# EAGLE design circuit_r2 (EAGLE 9.4.2)
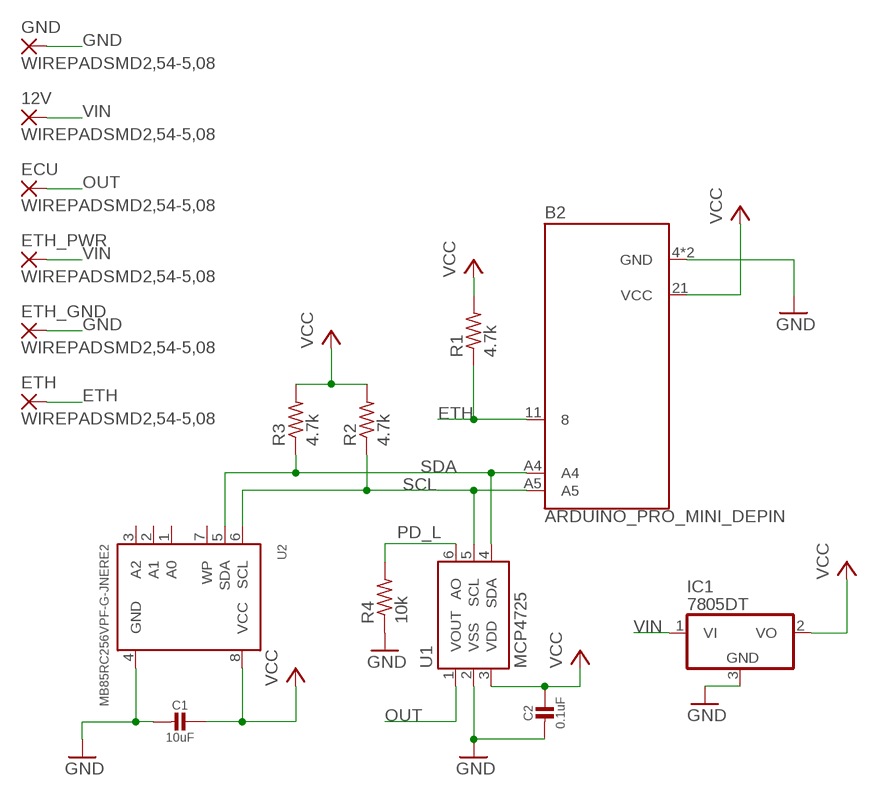
[diagram p0: schematic, sheet 1]

## Parts
12V  WIREPADSMD2,54-5,08  [SMD2,54-5,08]
B2  ARDUINO_PRO_MINI_DEPIN  [ARDUINO_PRO_MINI]
C1  10uF  CAP_CERAMIC_0805MP  [_0805MP]
C2  0.1uF  CAP_CERAMIC_0805MP  [_0805MP]
ECU  WIREPADSMD2,54-5,08  [SMD2,54-5,08]
ETH  WIREPADSMD2,54-5,08  [SMD2,54-5,08]
ETH_GND  WIREPADSMD2,54-5,08  [SMD2,54-5,08]
ETH_PWR  WIREPADSMD2,54-5,08  [SMD2,54-5,08]
GND  WIREPADSMD2,54-5,08  [SMD2,54-5,08]
IC1  7805DT  [TO252]
R1  4.7k  R-US_R0603  [R0603]
R2  4.7k  R-US_R0603  [R0603]
R3  4.7k  R-US_R0603  [R0603]
R4  10k  R-US_R0603  [R0603]
U1  MCP4725  MCP4725SOT-23  [SOT23-6]
U2  MB85RC256VPF-G-JNERE2  FRAM_SOIC8_I2C  [SOIC8_208MIL]

## Nets
ETH: B2.11 ETH.1(P) R1.1
GND: B2.4(GND) B2.23(GND) C1.2 C2.2 ETH_GND.1(P) GND.1(P) IC1.3(GND) R4.1 U1.2(VSS) U2.4(GND)
OUT: ECU.1(P) U1.1(VOUT)
PD_L: R4.2 U1.6(AO)
SCL: B2.A5 R2.1 U1.5(SCL) U2.6(SCL)
SDA: B2.A4 R3.1 U1.4(SDA) U2.5(SDA)
VCC: B2.21(VCC) C1.1 C2.1 IC1.2(VO) R1.2 R2.2 R3.2 U1.3(VDD) U2.8(VCC)
VIN: 12V.1(P) ETH_PWR.1(P) IC1.1(VI)
Unconnected: U2.1(A0) U2.2(A1) U2.3(A2) U2.7(WP)

## Library data of the parts
12V ECU ETH ETH_GND ETH_PWR GND = wirepad:WIREPAD: Wire PAD connect wire on PCB
B2 = SparkFun-Boards-revised:ARDUINO_PRO_MINI_DEPIN: SparkFun Pro Mini Pro Mini compatible footprint. Dimensions: 0.7 x 1.3" PCB Thickness: 0.8mm SparkFun Products: 3.3V/8MHz <https://www.sparkfun.com/products/11114> 5V/16MHz <https://www.sparkfun.com/products/11113>
C1 C2 = microbuilder:CAP_CERAMIC: Ceramic Capacitors For new designs, use the packages preceded by an '_' character since they are more reliable: The following footprints should be used on most boards: _0402 - Standard footprint for regular board layouts _0603 - Standard footprint for regular board layouts _0805 - Standard footprint for regular board layouts _1206 - Standard footprint for regular board layouts For extremely tight-pitch boards where space is at a premium, the following 'micro-pitch' footprints can be used (smaller pads, no silkscreen outline, etc.): _0402MP - Micro-pitch footprint for very dense/compact boards _0603MP - Micro-pitch footprint for very dense/compact boards _0805MP - Micro-pitch footprint for very dense/compact boards _1206MP - Micro-pitch footprint for very dense/compact boards
IC1 = adafruit:78*: Positive VOLTAGE REGULATOR Added bigger pads to the TO-92 package
R1-R4 = adafruit:R-US_: RESISTOR, American symbol
U1 = SparkFun-IC-Conversion:MCP4725: MCP4725 DAC Microchip 12-bit I2C DAC, SOT23-6 Datasheet <https://cdn.sparkfun.com/datasheets/BreakoutBoards/MCP4725_2009.pdf> SparkFun Products SparkFun I2C DAC Breakout - MCP4725 <https://www.sparkfun.com/products/12918> (BOB-12918); PROD_ID: IC-08886
U2 = microbuilder:FRAM_SOIC8_I2C: I2C FRAM - SOIC8 Package 256KBit (32Kx8) - MB85RC256VPF-G-JNERE2 - SOIC-8 200 Mil, 2.7-5.5V, -40°C-85°C

## Net classes
0 default: width 0.254 mm, clearance 0.205 mm

## Board
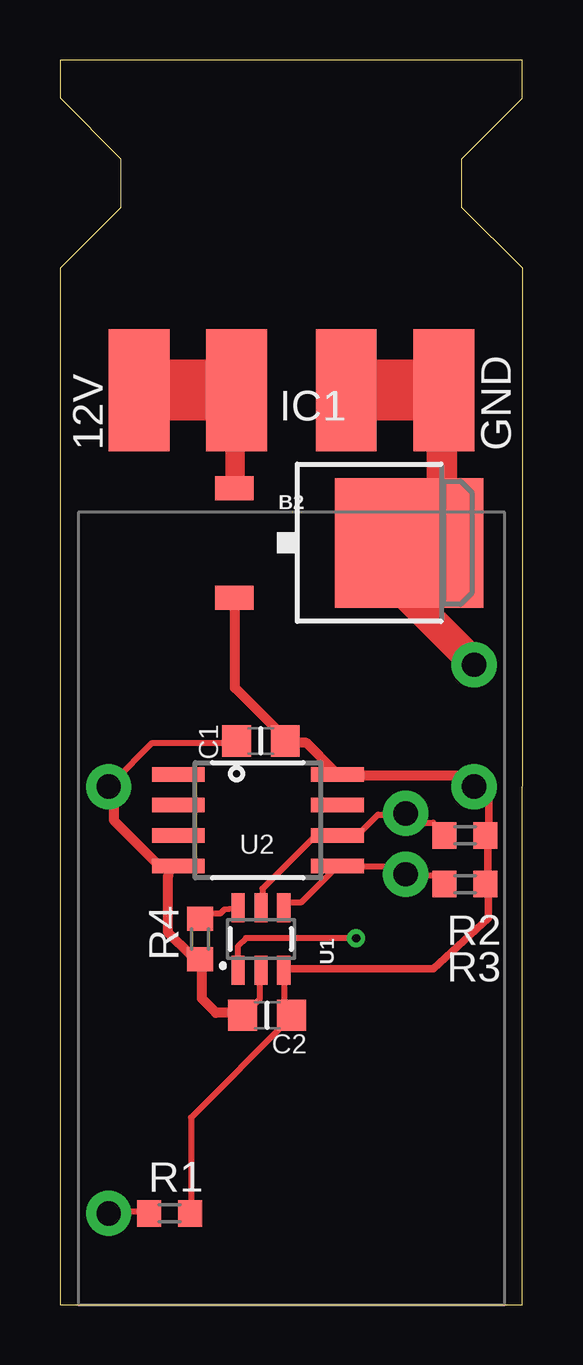
[diagram p1: board, top side]
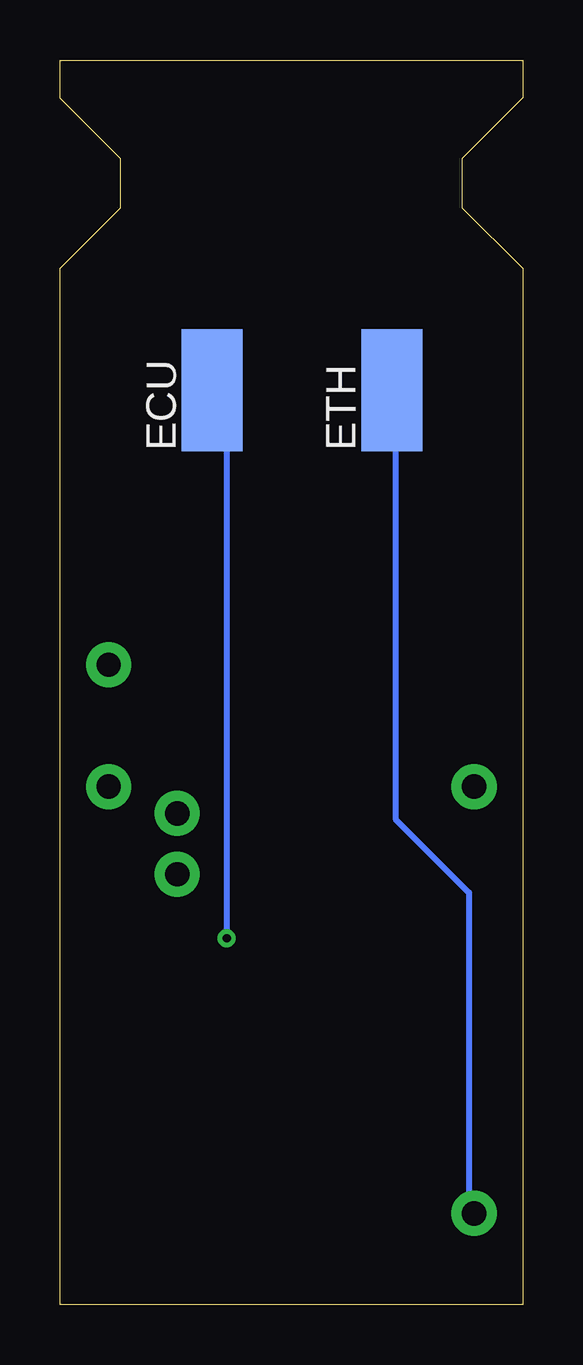
[diagram p2: board, bottom side, seen from below]

Size 19.3 x 51.87 mm. Coordinates in mm from the lower left corner, seen from the top.
Outline: 0,0 19.28,0 19.3,43.18 16.76,45.72 16.76,47.75 19.28,50.27 19.28,51.87 0,51.87 0,50.29 2.54,47.75 2.54,45.72 0,43.18 0,0
Copper layers (1*16): Top 0.035mm / dielectric 1.5mm / Bottom 0.035mm
Design rules "default": minimum track width 6mil, minimum drill 0.35mm, track to track 6mil, track to pad 6mil, pad to pad 6mil, via to via 6mil, smd to smd 6mil, copper to edge 40mil, drill to drill 6mil, minimum pad ring 10mil, minimum via ring 8mil, stop-mask expansion 4mil, vias tented up to drill 0mil, thermal gap 10mil

### Footprints (pad centres in the part's own frame; a part is rotated, then mirrored left to right if it is on the bottom)
SMD2,54-5,08 = smd 2.54 x 5.08: 1 0,0
ARDUINO_PRO_MINI = drill 1.016 pad 1.88: 4 -7.62,5.08; 11 -7.62,-12.7; 21 7.62,5.08; 23 7.62,10.16; A4 4.763,1.429; A5 4.763,3.969
_0805MP = smd 1.2 x 1.3: 1 -1.016,0; 2 1.016,0
TO252 = smd 1 x 1.6: 1 -2.28,-4.8; 2 2.28,-4.8 | smd 5.4 x 6.2: 3 0,2.5
R0603 = smd 1 x 1.1: 1 -0.85,0; 2 0.85,0
SOT23-6 = smd 0.55 x 1.2: 1 0.95,1.3; 2 0,1.3; 3 -0.95,1.3; 4 -0.95,-1.3; 5 0,-1.3; 6 0.95,-1.3
SOIC8_208MIL = smd 0.6 x 2.2: 1 -1.905,-3.315; 2 -0.635,-3.315; 3 0.635,-3.315; 4 1.905,-3.315; 5 1.905,3.315; 6 0.635,3.315; 7 -0.635,3.315; 8 -1.905,3.315

### Placement (x,y rotation side)
12V  3.3,38.1 0 top
B2  9.65,16.51 0 top
C1  8.38,23.5 180 top
C2  8.64,12.06 180 top
ECU  12.95,38.1 0 bottom
ETH  5.46,38.1 0 bottom
ETH_GND  11.94,38.1 0 top
ETH_PWR  7.37,38.1 0 top
GND  16,38.1 0 top
IC1  12.07,31.75 270 top
R1  4.57,3.81 0 top
R2  16.89,19.56 0 top
R3  16.89,17.53 0 top
R4  5.84,15.24 90 top
U1  8.38,15.24 180 top
U2  8.25,20.19 270 top

### Tracks (layer width: path | path; a pad name or v marks a point on that pad's centre or on a via)
ETH
  Top 0.254: R1.1 3.62,3.9 2.25,3.9 B2.11
  Bottom 0.254: B2.11 2.25,3.9 2.25,17.17 5.31,20.23 5.31,38.1 ETH.1
GND
  Top 0.254: 12.11,38.1 ETH_GND.1 | 15.79,38.1 GND.1 | 5.92,14.23 R4.1 5.46,14.56 | 7.52,12.16 C2.2 7.75,12.16 8.34,12.75 8.34,13.9 U1.2 | 4.52,17.89 U2.4 4.77,18.36 4.08,18.36 | C1.2 7.29,23.41 3.85,23.41 2.25,21.8 B2.4 2.25,21.57 | 14.64,29.38 14.64,31.72 IC1.3 | 17.16,26.85 B2.23
  Top 0.406: 5.92,14.23 5.92,12.75 6.51,12.16 7.52,12.16 | 4.52,17.89 4.52,15.5 5.46,14.56 | 4.08,18.36 2.25,20.2 2.25,21.57
  Top 1.27: 17.16,26.85 14.64,29.38 | IC1.3 14.69,31.75 15.93,32.99 15.93,38.1
  Top 2.54: 15.93,38.1 15.79,38.1 12.11,38.1
OUT  (via drill 0.35)
  Top 0.254: v12.35,15.27 7.75,15.27 7.43,14.96 U1.1
  Bottom 0.254: ECU.1 12.35,37.5 v12.35,15.27
PD_L
  Top 0.254: R4.2 5.92,16.29 6.68,16.29 6.86,16.47 U1.6
SCL
  Top 0.254: R2.1 15.55,20.09 14.97,20.09 14.64,20.43 B2.A5 14.41,20.43 13.26,20.43 12.57,19.74 11.66,19.74 U2.6 11.43,19.51 10.61,19.51 8.44,17.34 8.44,16.75 U1.5
SDA
  Top 0.254: U1.4 9.36,16.75 10.05,16.75 11.43,18.13 U2.5 11.59,18.26 14.41,18.26 B2.A4 14.64,17.9 15.96,17.9 R3.1
VCC
  Top 0.254: R1.2 5.46,3.9 5.46,7.8 9.59,11.93 C2.1 9.59,12.16 9.36,12.39 9.36,13.77 U1.3 9.36,14 | 17.85,17.65 R3.2 | 17.85,19.36 R2.2 | 17.88,21.09 17.39,21.57 B2.21 17.03,22.06 | 9.59,23.41 C1.1 9.36,23.64 | 11.43,22.26 U2.8 11.62,22.06 | 7.29,29.45 IC1.2
  Top 0.305: 17.85,19.36 17.85,17.65 | R2.2 17.88,19.69 17.88,21.09 | 9.36,14 15.57,14 17.87,16.11 17.87,17.4 R3.2
  Top 0.406: 9.59,23.41 10.28,23.41 11.43,22.26 | 7.29,29.45 7.29,25.7 9.36,23.64 | 11.62,22.06 17.03,22.06
VIN
  Top 0.254: 3.47,38.1 12V.1 | 7.14,38.1 7.29,38.1 ETH_PWR.1
  Top 0.813: IC1.1 7.29,34.06 7.29,38.1
  Top 2.54: 7.14,38.1 3.47,38.1